# Altium schematic sheet Sensors.SchDoc: Gimbal - Sensors
size Letter; DrawnBy: Aidan Gratton; Organization: UW Robotics; Address1: 200 University Avenue; Address2: Waterloo; Address3: Ontario; Address4: Canada N2L 3G6; SheetNumber: 5; SheetTotal: 7
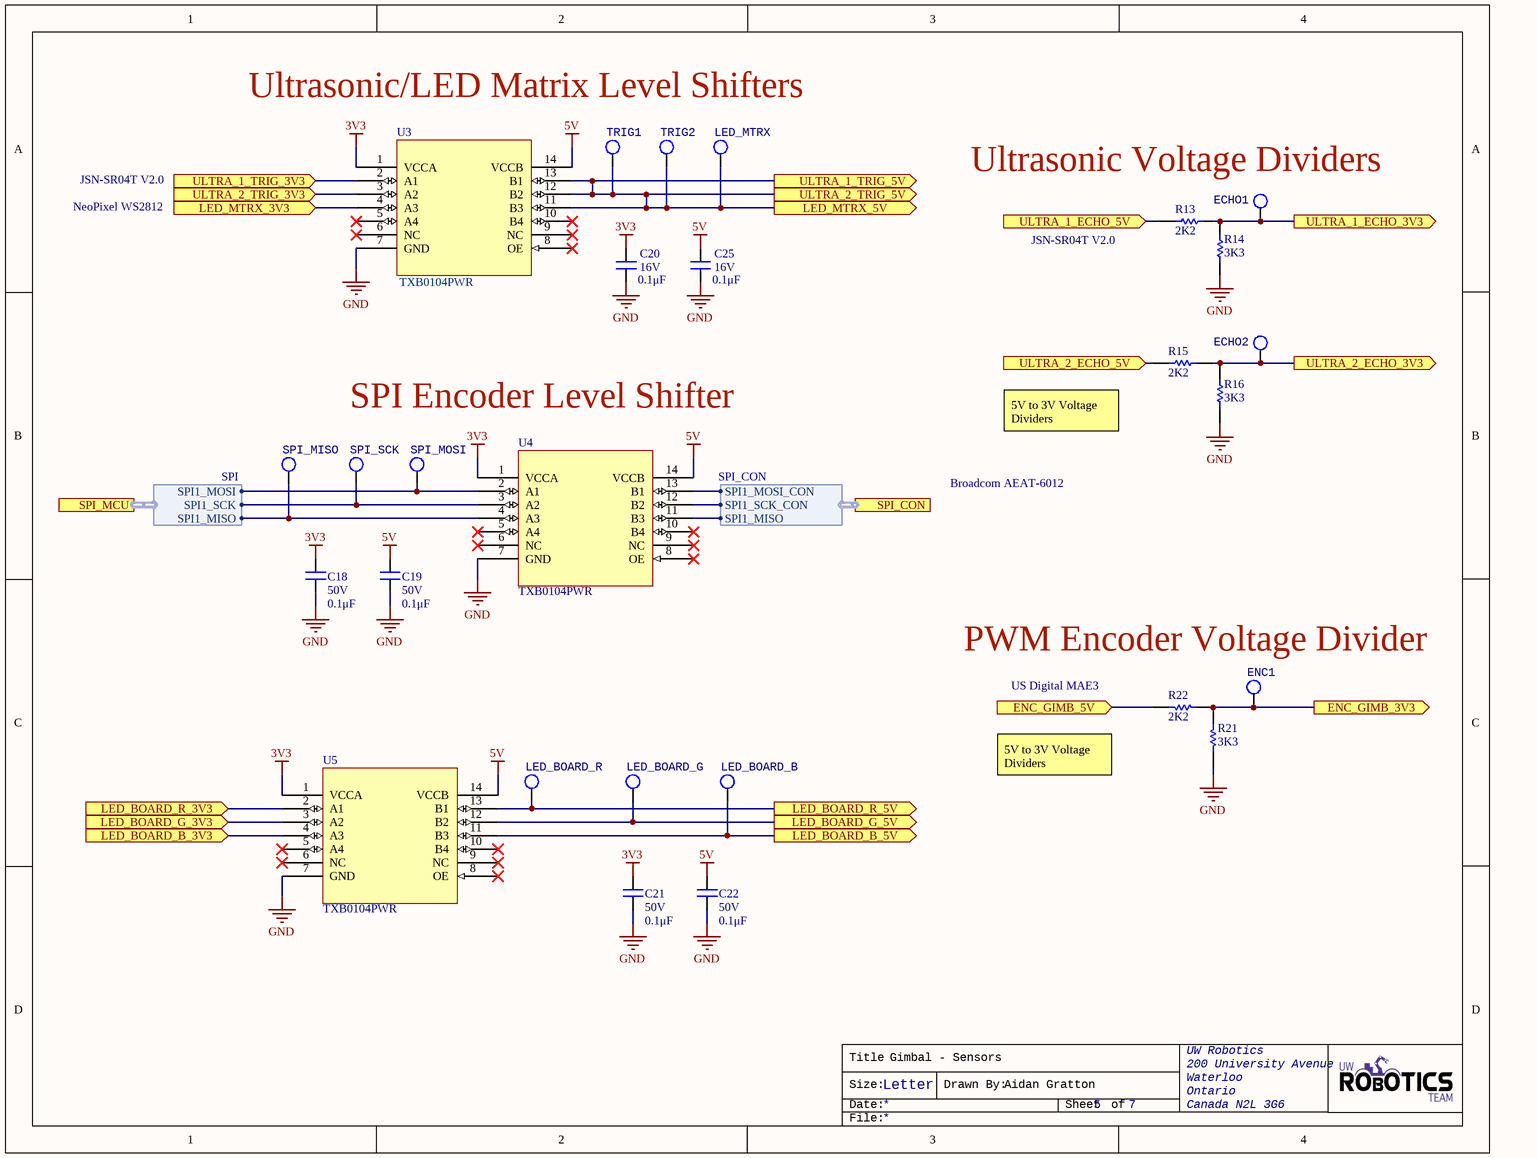
[diagram p0: Sensors.SchDoc]

## Parts
C18  value 0.1μF  Voltage Rating: 50V  [CAPC0603(1608)55_N]  (hidden comment: CAP_0.1uF_50V_0603)
C19  value 0.1μF  Voltage Rating: 50V  [CAPC0603(1608)55_N]  (hidden comment: CAP_0.1uF_50V_0603)
C20  value 0.1μF  Voltage Rating: 16V  [CAPC0603(1608)55_N]  (hidden comment: CAP_0.1uF_16V_0603)
C21  value 0.1μF  Voltage Rating: 50V  [CAPC0603(1608)55_N]  (hidden comment: CAP_0.1uF_50V_0603)
C22  value 0.1μF  Voltage Rating: 50V  [CAPC0603(1608)55_N]  (hidden comment: CAP_0.1uF_50V_0603)
C25  value 0.1μF  Voltage Rating: 16V  [CAPC0603(1608)55_N]  (hidden comment: CAP_0.1uF_16V_0603)
ECHO1  TESTPOINT_LOOP  [TESTPOINT_LOOP]  (value not drawn)
ECHO2  TESTPOINT_LOOP  [TESTPOINT_LOOP]  (value not drawn)
ENC1  TESTPOINT_LOOP  [TESTPOINT_LOOP]  (value not drawn)
LED_BOARD_B  TESTPOINT_LOOP  [TESTPOINT_LOOP]  (value not drawn)
LED_BOARD_G  TESTPOINT_LOOP  [TESTPOINT_LOOP]  (value not drawn)
LED_BOARD_R  TESTPOINT_LOOP  [TESTPOINT_LOOP]  (value not drawn)
LED_MTRX  TESTPOINT_LOOP  [TESTPOINT_LOOP]  (value not drawn)
R13  value 2K2  [RESC0603(1608)_N]  (hidden comment: RES_2K2_0603)
R14  value 3K3  [RESC0603(1608)_N]  (hidden comment: RES_3K3_0603)
R15  value 2K2  [RESC0603(1608)_N]  (hidden comment: RES_2K2_0603)
R16  value 3K3  [RESC0603(1608)_N]  (hidden comment: RES_3K3_0603)
R21  value 3K3  [RESC0603(1608)_N]  (hidden comment: RES_3K3_0603)
R22  value 2K2  [RESC0603(1608)_N]  (hidden comment: RES_2K2_0603)
SPI_MISO  TESTPOINT_LOOP  [TESTPOINT_LOOP]  (value not drawn)
SPI_MOSI  TESTPOINT_LOOP  [TESTPOINT_LOOP]  (value not drawn)
SPI_SCK  TESTPOINT_LOOP  [TESTPOINT_LOOP]  (value not drawn)
TRIG1  TESTPOINT_LOOP  [TESTPOINT_LOOP]  (value not drawn)
TRIG2  TESTPOINT_LOOP  [TESTPOINT_LOOP]  (value not drawn)
U3  TXB0104PWR  [PW14]
U4  TXB0104PWR  [PW14]
U5  TXB0104PWR  [PW14]

## Ports
ENC_GIMB_3V3 (out), ENC_GIMB_5V (in), LED_BOARD_B_3V3 (in), LED_BOARD_B_5V (out), LED_BOARD_G_3V3 (in), LED_BOARD_G_5V (out), LED_BOARD_R_3V3 (in), LED_BOARD_R_5V (out), LED_MTRX_3V3 (in), LED_MTRX_5V (out), SPI_CON (harness SPI_CON), SPI_MCU (harness SPI), ULTRA_1_ECHO_3V3 (out), ULTRA_1_ECHO_5V (in), ULTRA_1_TRIG_3V3 (in), ULTRA_1_TRIG_5V (out), ULTRA_2_ECHO_3V3 (out), ULTRA_2_ECHO_5V (in), ULTRA_2_TRIG_3V3 (in), ULTRA_2_TRIG_5V (out)

## Harnesses
SPI: SPI1_MISO, SPI1_MOSI, SPI1_SCK
SPI_CON: SPI1_MISO, SPI1_MOSI_CON, SPI1_SCK_CON

## Nets
3V3: C18.2 C20.2 C21.2 U3.1(VCCA) U4.1(VCCA) U5.1(VCCA)
5V: C19.2 C22.2 C25.2 U3.14(VCCB) U4.14(VCCB) U5.14(VCCB)
GND: C18.1 C19.1 C20.1 C21.1 C22.1 C25.1 R14.1 R16.2 R21.2 U3.7(GND) U4.7(GND) U5.7(GND)
ENC_GIMB_3V3: ENC1.1 R21.1 R22.1 ; port ENC_GIMB_3V3
ENC_GIMB_5V: R22.2 ; port ENC_GIMB_5V
LED_BOARD_B_3V3: U5.4(A3) ; port LED_BOARD_B_3V3
LED_BOARD_B_5V: LED_BOARD_B.1 U5.11(B3) ; port LED_BOARD_B_5V
LED_BOARD_G_3V3: U5.3(A2) ; port LED_BOARD_G_3V3
LED_BOARD_G_5V: LED_BOARD_G.1 U5.12(B2) ; port LED_BOARD_G_5V
LED_BOARD_R_3V3: U5.2(A1) ; port LED_BOARD_R_3V3
LED_BOARD_R_5V: LED_BOARD_R.1 U5.13(B1) ; port LED_BOARD_R_5V
LED_MTRX_3V3: U3.4(A3) ; port LED_MTRX_3V3
LED_MTRX_5V: LED_MTRX.1 TRIG1.1 TRIG2.1 U3.11(B3) U3.12(B2) U3.13(B1) ; port ULTRA_1_TRIG_5V, port ULTRA_2_TRIG_5V, port LED_MTRX_5V
ULTRA_1_ECHO_3V3: ECHO1.1 R13.1 R14.2 ; port ULTRA_1_ECHO_3V3
ULTRA_1_ECHO_5V: R13.2 ; port ULTRA_1_ECHO_5V
ULTRA_1_TRIG_3V3: U3.2(A1) ; port ULTRA_1_TRIG_3V3
ULTRA_2_ECHO_3V3: ECHO2.1 R15.1 R16.1 ; port ULTRA_2_ECHO_3V3
ULTRA_2_ECHO_5V: R15.2 ; port ULTRA_2_ECHO_5V
ULTRA_2_TRIG_3V3: U3.3(A2) ; port ULTRA_2_TRIG_3V3
NetSPI_MISO_1: SPI_MISO.1 U4.4(A3) ; port SPI_MCU.SPI1_MISO
NetSPI_MOSI_1: SPI_MOSI.1 U4.2(A1) ; port SPI_MCU.SPI1_MOSI
NetSPI_SCK_1: SPI_SCK.1 U4.3(A2) ; port SPI_MCU.SPI1_SCK
NetU4_11: U4.11(B3) ; port SPI_CON.SPI1_MISO
NetU4_12: U4.12(B2) ; port SPI_CON.SPI1_SCK_CON
NetU4_13: U4.13(B1) ; port SPI_CON.SPI1_MOSI_CON

Not connected (* = marked no-connect by the designer): U3 5(A4)* 6(NC)* 8(OE)* 9(NC)* 10(B4)*; U4 5(A4)* 6(NC)* 8(OE)* 9(NC)* 10(B4)*; U5 5(A4)* 6(NC)* 8(OE)* 9(NC)* 10(B4)*

## Notes on the sheet
- Ultrasonic/LED Matrix Level Shifters
- NeoPixel WS2812
- JSN-SR04T V2.0
- Ultrasonic Voltage Dividers
- SPI Encoder Level Shifter
- 5V to 3V Voltage Dividers
- Broadcom AEAT-6012
- PWM Encoder Voltage Divider
- US Digital MAE3
- Title
- Size:
- Date:
- Letter
- Drawn By:
- Sheet
- of
- File:

## Library data of the parts
C18 C19 C21 C22 = CAP_0.1uF_50V_0603: CAP CER 0.1UF 50V X7R 0603; Manufacturer Part Number 1: CC0603KRX7R9BB104; Manufacturer 1: Yageo; Dimensions: 0.063" L x 0.031" W (1.60mm x 0.80mm); Package: 0603 (1608 Metric); Temperature Coefficient: X7R; Supplier Part Number 1: 311-1344-1-ND; Supplier 1: Digi-Key; Mount: Surface Mount; Case Code (Imperial): 0603; Case Code (Metric): 1608; Dielectric: X7R
C20 C25 = CAP_0.1uF_16V_0603: CAP CER 0.1UF 16V X7R 0603; Manufacturer Part Number 1: CC0603KRX7R7BB104; Manufacturer 1: Yageo; Dimensions: 0.063" L x 0.031" W (1.60mm x 0.80mm); Package: 0603 (1608 Metric); Temperature Coefficient: X7R; Supplier Part Number 1: 311-1088-1-ND; Supplier 1: Digi-Key; Mount: Surface Mount; Case Code (Imperial): 0603; Case Code (Metric): 1608; Dielectric: X7R
ECHO1 ECHO2 ENC1 LED_BOARD_B LED_BOARD_G LED_BOARD_R SPI_MISO SPI_MOSI SPI_SCK TRIG1 TRIG2 = TESTPOINT_LOOP: Loop testpoint through-hole pad; Manufacturer Part Number 1: 5002; Manufacturer 1: Keystone Electronics; Supplier Part Number 1: 36-5002-ND; Supplier 1: Digi-Key; Mount: Through Hole
LED_MTRX = TESTPOINT_LOOP: Loop testpoint through-hole pad; Manufacturer 1: Keystone Electronics; Manufacturer Part Number 1: 5002; Supplier Part Number 1: 36-5002-ND; Supplier 1: Digi-Key; Mount: Through Hole
R13 R15 R22 = RES_2K2_0603: RES SMD 2.2K OHM 1% 1/10W 0603; Manufacturer: Yageo; MPN: RC0603FR-072K2L; Dimensions: 0.063" L x 0.031" W (1.60mm x 0.80mm); Package: 0603 (1608 Metric); Tolerance: 1%; Supplier Part Number 1: 311-2.20KHRCT-ND; Supplier 1: Digi-Key
R14 = RES_3K3_0603: RES SMD 3.3K OHM 5% 1/10W 0603; Manufacturer 1: Yageo; Manufacturer Part Number 1: RC0603JR-073K3L; Dimensions: 0.063" L x 0.031" W (1.60mm x 0.80mm); Package: 0603 (1608 Metric); Tolerance: 5%; Digikey Part Number: 311-3.3KGRCT-ND; Supplier 1: Digi-Key; Supplier Part Number 1: 311-3.3KGRCT-ND; Mount: Surface Mount
R16 R21 = RES_3K3_0603: RES SMD 3.3K OHM 5% 1/10W 0603; Manufacturer: Yageo; MPN: RC0603JR-073K3L; Dimensions: 0.063" L x 0.031" W (1.60mm x 0.80mm); Package: 0603 (1608 Metric); Tolerance: 5%; Digikey Part Number: 311-3.3KGRCT-ND; Supplier 1: Digi-Key; Supplier Part Number 1: 311-3.3KGRCT-ND
U3-U5 = IC_4CH_LVL_SHIFTER: 4-Bit Bidirectional Voltage-Level Translator with Auto Direction Sensing / VCCA < VCCB, see datasheet; Manufacturer 1: Texas Instruments; PACKAGE_DESIGNATOR: PW; PIN_COUNT: 14; FAMILY_NAME: AUTO DIRECTION SENSING DUAL SUPPLY TRANSLATOR; INDUSTRY_STD_PKG_TYPE: TSSOP; VCCB MAX: 5.5 V; VCCA MAX: 3.6 V; GENERIC_PART_NUMBER: TXB0104; Datasheet_URL: http://www.ti.com/lit/gpn/TXB0104; Supplier 1: Digi-Key; Supplier Part Number 1: 296-21929-1-ND; Manufacturer Part Number 1: TXB0104PWR